# EAGLE schematic arduino_sheild (EAGLE 7.3.0)

## Sheet 1 of 2: Arduino Sheild
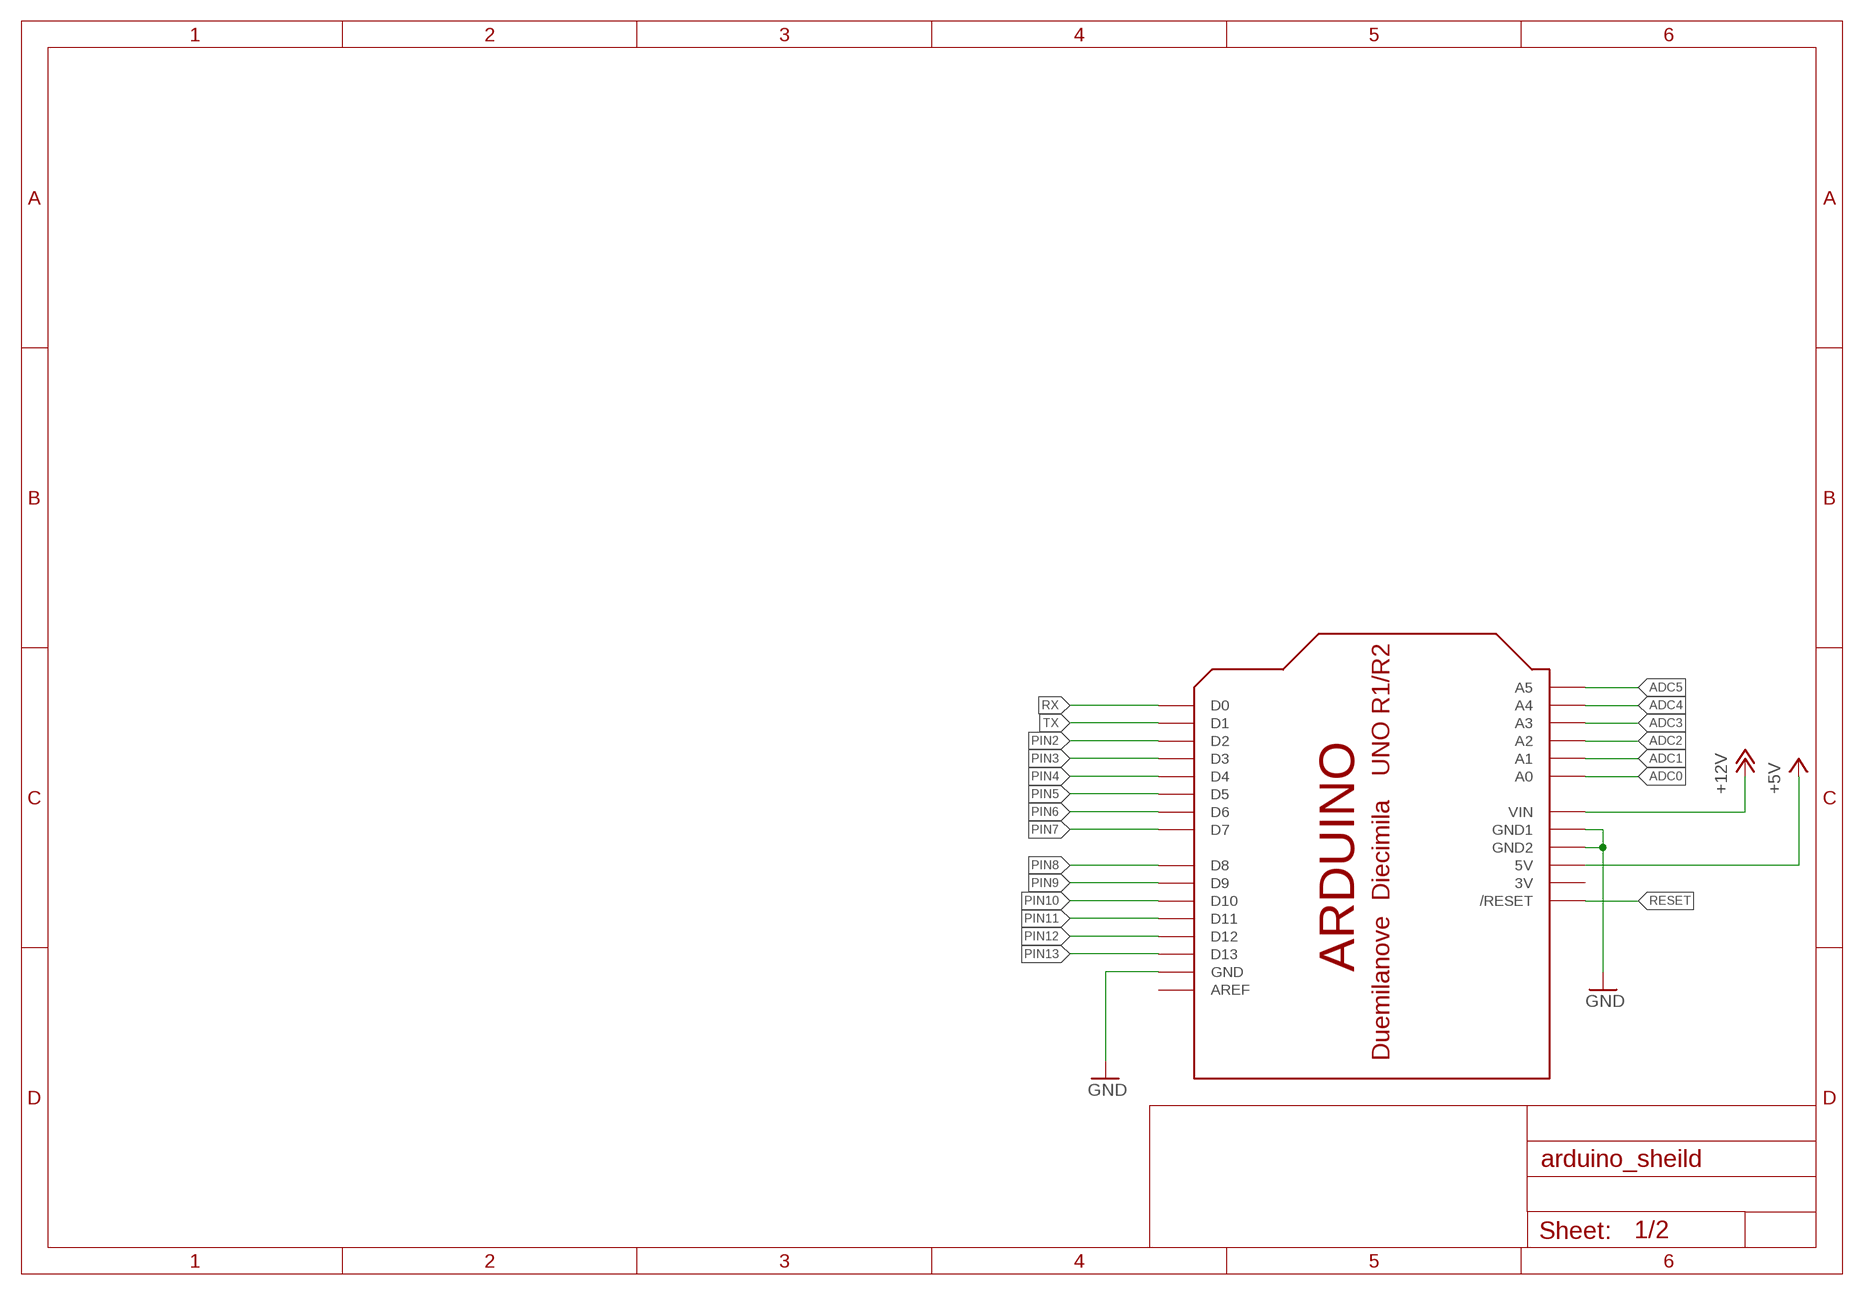
[diagram p0: schematic, sheet 1]

### Parts
U$3  ARDUINOUNO  [ARDUINO]

### Nets
+5V: U$3.5V ; also sheet 2
+12V: U$3.VIN ; also sheet 2
ADC0: U$3.A0
ADC1: U$3.A1
ADC2: U$3.A2
ADC3: U$3.A3
ADC4: U$3.A4
ADC5: U$3.A5
GND: U$3.GND U$3.GND1 U$3.GND2 ; also sheet 2
PIN2: U$3.D2
PIN3: U$3.D3
PIN4: U$3.D4
PIN5: U$3.D5
PIN6: U$3.D6
PIN7: U$3.D7
PIN8: U$3.D8
PIN9: U$3.D9
PIN10: U$3.D10
PIN11: U$3.D11
PIN12: U$3.D12
PIN13: U$3.D13
RESET: U$3.RESET(/RESET)
RX: U$3.D0
TX: U$3.D1
Unconnected: U$3.AREF

## Sheet 2 of 2: Output stage
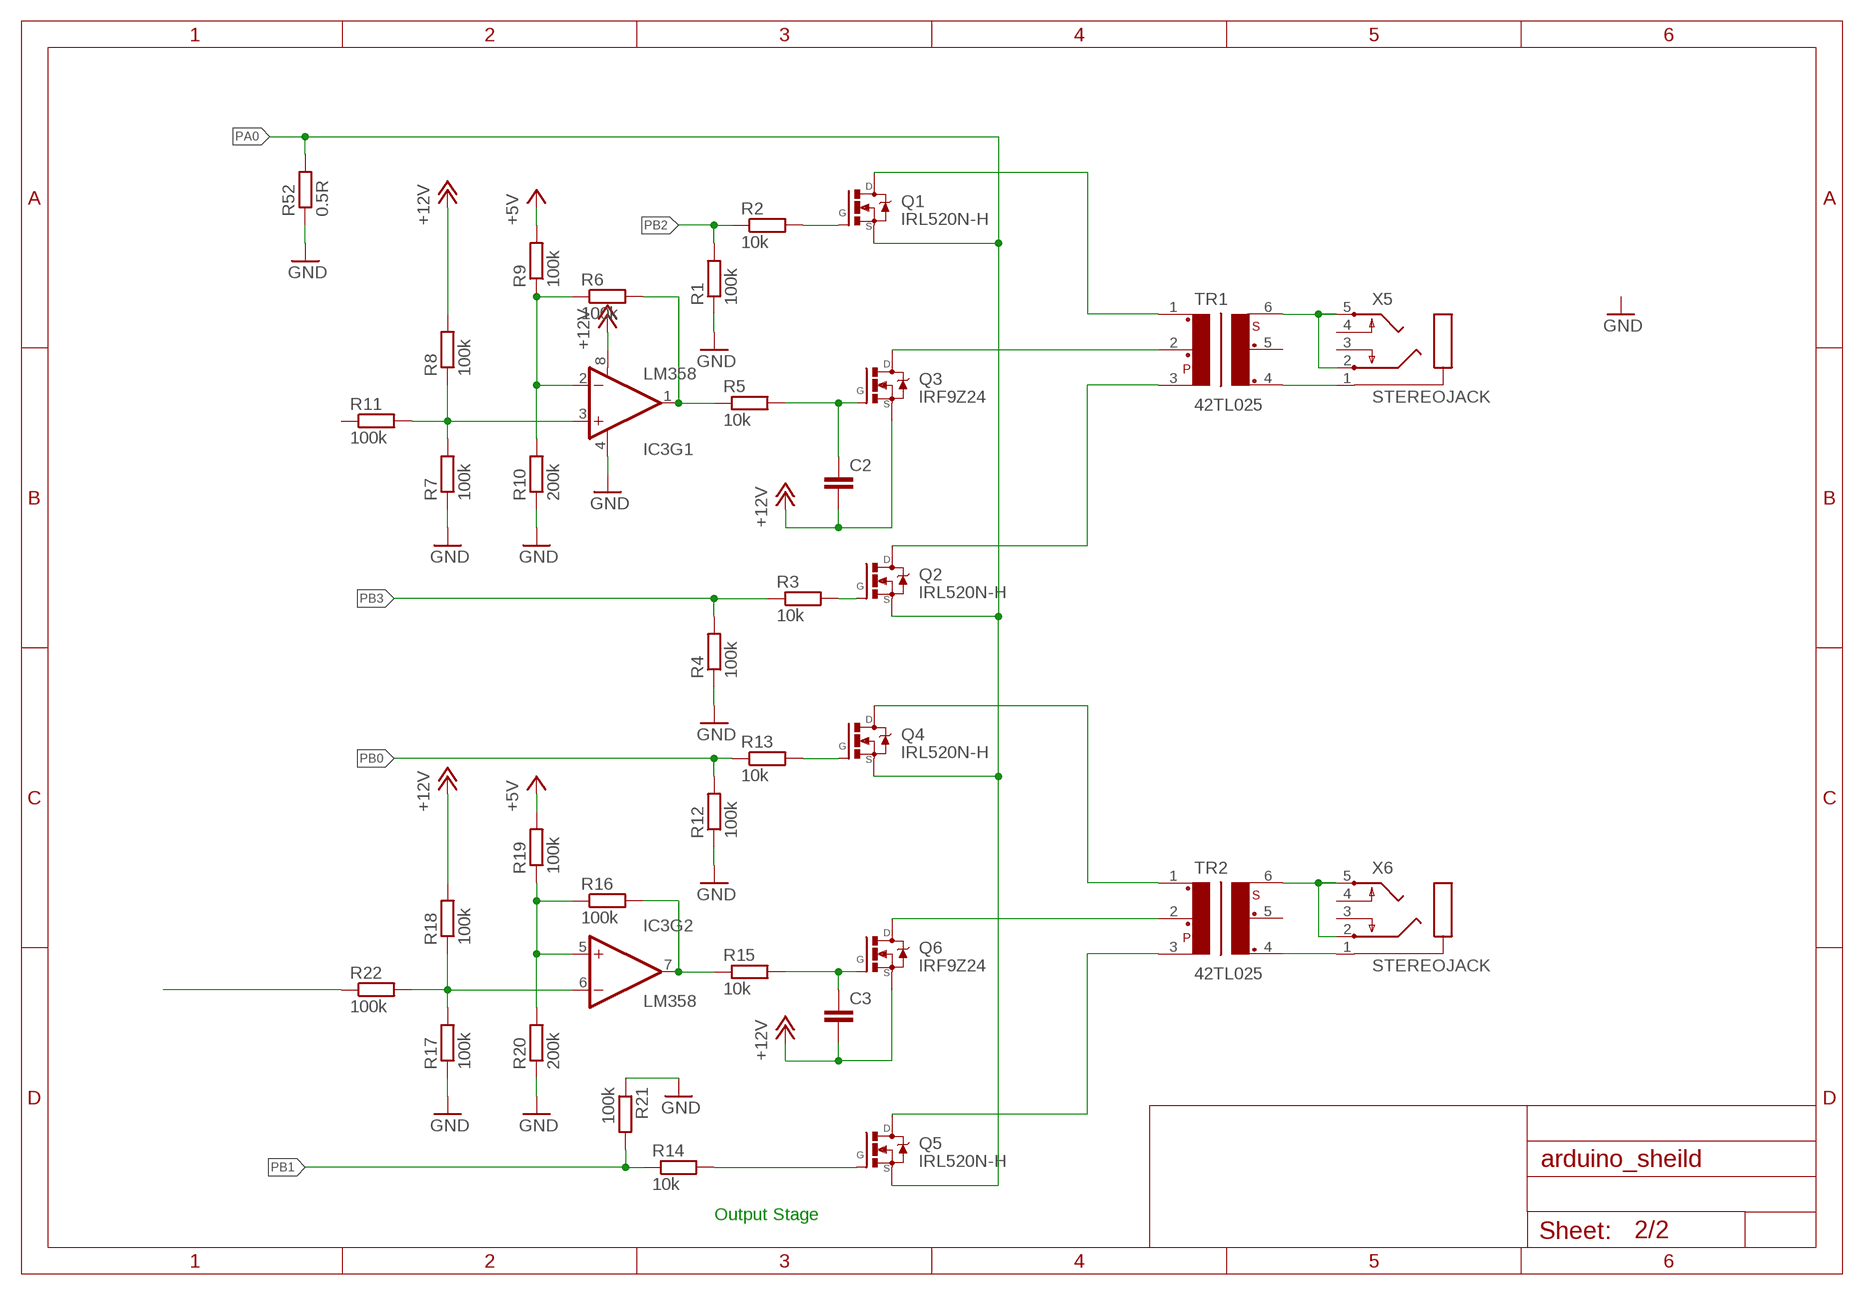
[diagram p1: schematic, sheet 2]

### Parts
C2  CAPPTH  [CAP-PTH-SMALL]
C3  CAPPTH  [CAP-PTH-SMALL]
IC3  LM358  [DIP08]
Q1  IRL520N-H  IRL530N-H  [TO220]
Q2  IRL520N-H  IRL530N-H  [TO220]
Q3  IRF9Z24  IRL530N-H  [TO220]
Q4  IRL520N-H  IRL530N-H  [TO220]
Q5  IRL520N-H  IRL530N-H  [TO220]
Q6  IRF9Z24  IRL530N-H  [TO220]
R1  100k  R0207/10  [0207/10]
R2  10k  R0207/10  [0207/10]
R3  10k  R0207/10  [0207/10]
R4  100k  R0207/10  [0207/10]
R5  10k  R0207/10  [0207/10]
R6  100k  R0207/10  [0207/10]
R7  100k  R0207/10  [0207/10]
R8  100k  R0207/10  [0207/10]
R9  100k  R0207/10  [0207/10]
R10  200k  R0207/10  [0207/10]
R11  100k  R0207/10  [0207/10]
R12  100k  R0207/10  [0207/10]
R13  10k  R0207/10  [0207/10]
R14  10k  R0207/10  [0207/10]
R15  10k  R0207/10  [0207/10]
R16  100k  R0207/10  [0207/10]
R17  100k  R0207/10  [0207/10]
R18  100k  R0207/10  [0207/10]
R19  100k  R0207/10  [0207/10]
R20  200k  R0207/10  [0207/10]
R21  100k  R0207/10  [0207/10]
R22  100k  R0207/10  [0207/10]
R52  0.5R  R0207/10  [0207/10]
TR1  42TL025  [42TL]
TR2  42TL025  [42TL]
X5  STEREOJACK  [STX3100]
X6  STEREOJACK  [STX3100]

### Nets
+5V: R9.2 R19.2 ; also sheet 1
+12V: C2.2 C3.2 IC3.8(V+) Q3.3(S) Q6.3(S) R8.2 R18.2 ; also sheet 1
GND: IC3.4(V-) R1.1 R4.1 R7.1 R10.1 R12.1 R17.1 R20.1 R21.1 R52.1 ; also sheet 1
N$1: TR1.4 X5.1
N$2: TR1.6 X5.2 X5.5
N$3: TR2.6 X6.2 X6.5
N$4: TR2.4 X6.1
N$18: Q1.1(G) R2.2
N$19: Q2.1(G) R3.2
N$20: IC3.1(OUT) R5.1 R6.2
N$21: C2.1 Q3.1(G) R5.2
N$22: IC3.3(+IN) R7.2 R8.1 R11.2
N$24: Q4.1(G) R13.2
N$25: Q5.1(G) R14.2
N$26: IC3.7(OUT) R15.1 R16.2
N$27: C3.1 Q6.1(G) R15.2
N$28: IC3.6(-IN) R17.2 R18.1 R22.2
N$33: R22.1
N$34: Q1.2(D) TR1.1
N$35: Q3.2(D) TR1.2
N$36: Q4.2(D) TR2.1
N$37: Q6.2(D) TR2.2
N$38: Q5.2(D) TR2.3
N$39: Q2.2(D) TR1.3
N$40: IC3.2(-IN) R6.1 R9.1 R10.2
N$41: IC3.5(+IN) R16.1 R19.1 R20.2
PA0: Q1.3(S) Q2.3(S) Q4.3(S) Q5.3(S) R52.2
PB0: R12.2 R13.1
PB1: R14.1 R21.2
PB2: R1.2 R2.1
PB3: R3.1 R4.2
Unconnected: R11.1 TR1.5 TR2.5 X5.3 X5.4 X6.3 X6.4

### Notes on the sheet
- Output Stage

## Power pins joined to a net without a drawn wire
3V: U$3.3V

## Library data of the parts
C2 C3 = SparkFun-Passives:CAP: Capacitor Standard 0603 ceramic capacitor, and 0.1" leaded capacitor.
IC3 = SparkFun-AnalogIC:LM358: Jellybean op-amp; PROD_ID: IC-09172
Q1-Q6 = transistor-fet-1:IRL530: MOSFET 17A 22.7nC 100mOhm Logic Level
R1-R22 R52 = eagle-ltspice:R: RESISTOR, European symbol; SPICEMODEL: NONE; SPICEPREFIX: R
TR1 TR2 = trafo-xicon:42T?*: Xicon Micro-Mini EI-12 Audio Transformers 42TL/42TC/42TM Series Source: http://www.mouser.com//catalog/specsheets/164201.pdf http://www.mouser.com/catalog/specsheets/114225.pdf http://www.mouser.com/catalog/specsheets/164267.pdf; OC_FARNELL: unknown; OC_NEWARK: unknown
U$3 = adafruit:ARDUINO: Arduino Diecimila/Duemilanove Make a shield with ease, this package has all the named pins as well as the two mounting drill holes and an outline of the USB and DC power connector. The outline is on the DIMENSION layer, so if your board house uses it they will cut the outline to match. http://www.ladyada.net/library/pcb/eaglelibrary.html
X5 X6 = adafruit:STEREOJACK: MIC/HEADPHONE JACK Stereo jack with two switches. Kycon STX3100, CUI SJ1-3555NG and/or 4UCon 05544

## Net classes
0 default: width 0.4 mm
1 signal: width 0.254 mm
2 pwr: width 2 mm